# Altium schematic sheet Memory Address Decoder.SchDoc
size A; Author: E. Sims; Organization: Let's Build Rockets Inc.; SheetNumber: 9; SheetTotal: 10
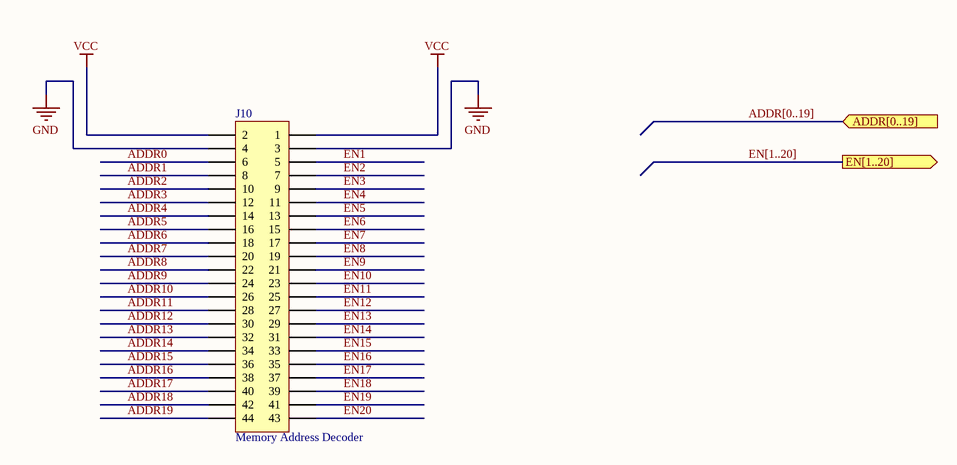
[diagram p0: Memory Address Decoder.SchDoc]

## Parts
J10  Memory Address Decoder  [HDR2X22]

## Ports
ADDR[0..19] (in), EN[1..20] (out)

## Nets
GND: J10.3 J10.4
VCC: J10.1 J10.2
ADDR0: J10.6
ADDR1: J10.8
ADDR2: J10.10
ADDR3: J10.12
ADDR4: J10.14
ADDR5: J10.16
ADDR6: J10.18
ADDR7: J10.20
ADDR8: J10.22
ADDR9: J10.24
ADDR10: J10.26
ADDR11: J10.28
ADDR12: J10.30
ADDR13: J10.32
ADDR14: J10.34
ADDR15: J10.36
ADDR16: J10.38
ADDR17: J10.40
ADDR18: J10.42
ADDR19: J10.44
EN1: J10.5
EN2: J10.7
EN3: J10.9
EN4: J10.11
EN5: J10.13
EN6: J10.15
EN7: J10.17
EN8: J10.19
EN9: J10.21
EN10: J10.23
EN11: J10.25
EN12: J10.27
EN13: J10.29
EN14: J10.31
EN15: J10.33
EN16: J10.35
EN17: J10.37
EN18: J10.39
EN19: J10.41
EN20: J10.43

## Buses and harness runs
bus ADDR[0..19] = port ADDR[0..19]
bus EN[1..20] = port EN[1..20]

## Notes on the sheet
- Let's Build Rocket's Inc. Modular Paylaod System Based on TMP-010 Rev
  For more information visit https://github.com/LetsBuildRockets/Modular-Payload-System
  This work is licensed under CC BY-NC 4.0. To view a copy of this license, visit https://creativecommons.org/licenses/by-nc/4.0
- Title
- Size:
- Date:
- Assembly Variant:
- B
- Number:
- Time:
- Revision:
- Sheet
- of
- Author:
- File:

## Library data of the parts
J10 = Header 22X2: Header, 22-Pin, Dual row; System: Connector; LatestRevisionDate: 17-Jul-2002; LatestRevisionNote: Re-released for DXP Platform.; Publisher: Altium Limited